# EAGLE design in-15a-single (EAGLE 6.4)
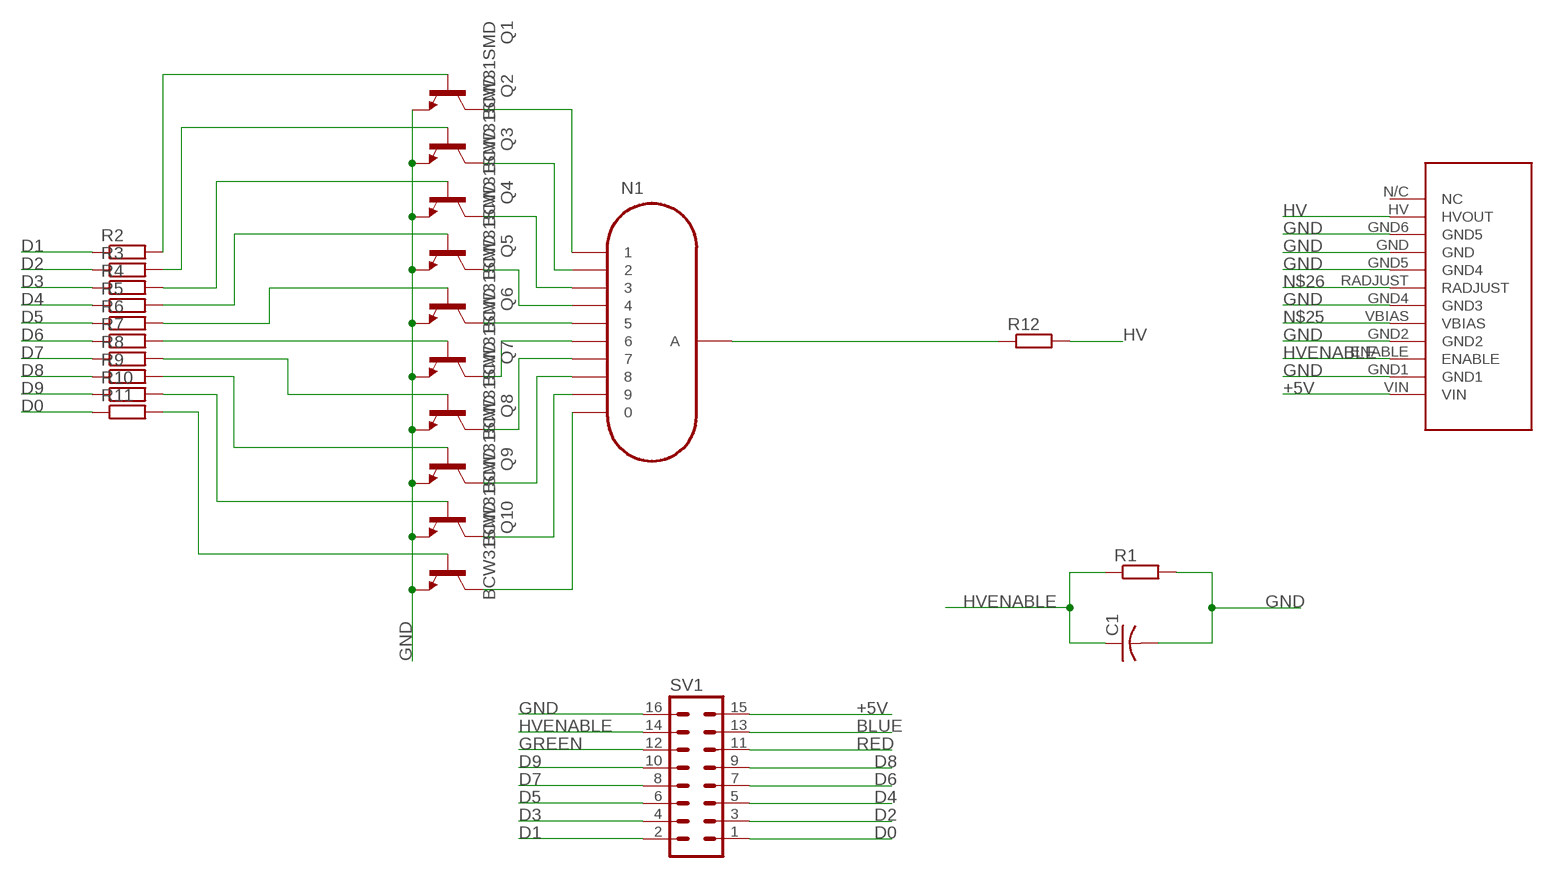
[diagram p0: schematic, sheet 1]

## Parts
C1  C-USC0805  [C0805]
N1  IN-12A  [IN-12-BIG]
Q1  BCW31SMD  [SOT23-BEC]
Q2  BCW31SMD  [SOT23-BEC]
Q3  BCW31SMD  [SOT23-BEC]
Q4  BCW31SMD  [SOT23-BEC]
Q5  BCW31SMD  [SOT23-BEC]
Q6  BCW31SMD  [SOT23-BEC]
Q7  BCW31SMD  [SOT23-BEC]
Q8  BCW31SMD  [SOT23-BEC]
Q9  BCW31SMD  [SOT23-BEC]
Q10  BCW31SMD  [SOT23-BEC]
R1  R-EU_M0805  [M0805]
R2  R-EU_M0805  [M0805]
R3  R-EU_M0805  [M0805]
R4  R-EU_M0805  [M0805]
R5  R-EU_M0805  [M0805]
R6  R-EU_M0805  [M0805]
R7  R-EU_M0805  [M0805]
R8  R-EU_M0805  [M0805]
R9  R-EU_M0805  [M0805]
R10  R-EU_M0805  [M0805]
R11  R-EU_M0805  [M0805]
R12  R-EU_M0805  [M0805]
SV1  ML16  [ML16]
U$1  HV-MODULE-EBAY  [NIIE-HV]

## Nets
+5V: SV1.15 U$1.VIN
BLUE: SV1.13
D0: R11.1 SV1.1
D1: R2.1 SV1.2
D2: R3.1 SV1.3
D3: R4.1 SV1.4
D4: R5.1 SV1.5
D5: R6.1 SV1.6
D6: R7.1 SV1.7
D7: R8.1 SV1.8
D8: R9.1 SV1.9
D9: R10.1 SV1.10
GND: C1.2 Q1.E Q2.E Q3.E Q4.E Q5.E Q6.E Q7.E Q8.E Q9.E Q10.E R1.2 SV1.16 U$1.GND U$1.GND1 U$1.GND2 U$1.GND4(GND3) U$1.GND5(GND4) U$1.GND6(GND5)
GREEN: SV1.12
HV: R12.2 U$1.HV(HVOUT)
HVENABLE: C1.1 R1.1 SV1.14 U$1.ENABLE
N$2: N1.1 Q1.C
N$3: N1.2 Q2.C
N$4: N1.3 Q3.C
N$5: N1.4 Q4.C
N$6: N1.5 Q5.C
N$7: N1.6 Q6.C
N$8: N1.7 Q7.C
N$9: N1.8 Q8.C
N$10: N1.9 Q9.C
N$11: N1.0 Q10.C
N$12: Q1.B R2.2
N$13: Q2.B R3.2
N$14: Q3.B R4.2
N$15: Q4.B R5.2
N$16: Q5.B R6.2
N$17: Q6.B R7.2
N$18: Q7.B R8.2
N$19: Q8.B R9.2
N$20: Q9.B R10.2
N$21: Q10.B R11.2
N$22: N1.A R12.1
N$25: U$1.VBIAS
N$26: U$1.RADJUST
RED: SV1.11
Unconnected: U$1.N/C(NC)

## Library data of the parts
C1 = adafruit:C-US: CAPACITOR, American symbol
N1 = russian-nixies:IN-12A: IN-12A: medium numeric topview nixie tube
Q1-Q10 = transistor-npn:BCW31*: NPN Transistor
R1-R12 = resistor:R-EU_: RESISTOR, European symbol
SV1 = con-ml:ML16: HARTING; OC_FARNELL: unknown; OC_NEWARK: unknown
U$1 = mgregg:HV-MODULE-EBAY

## Board
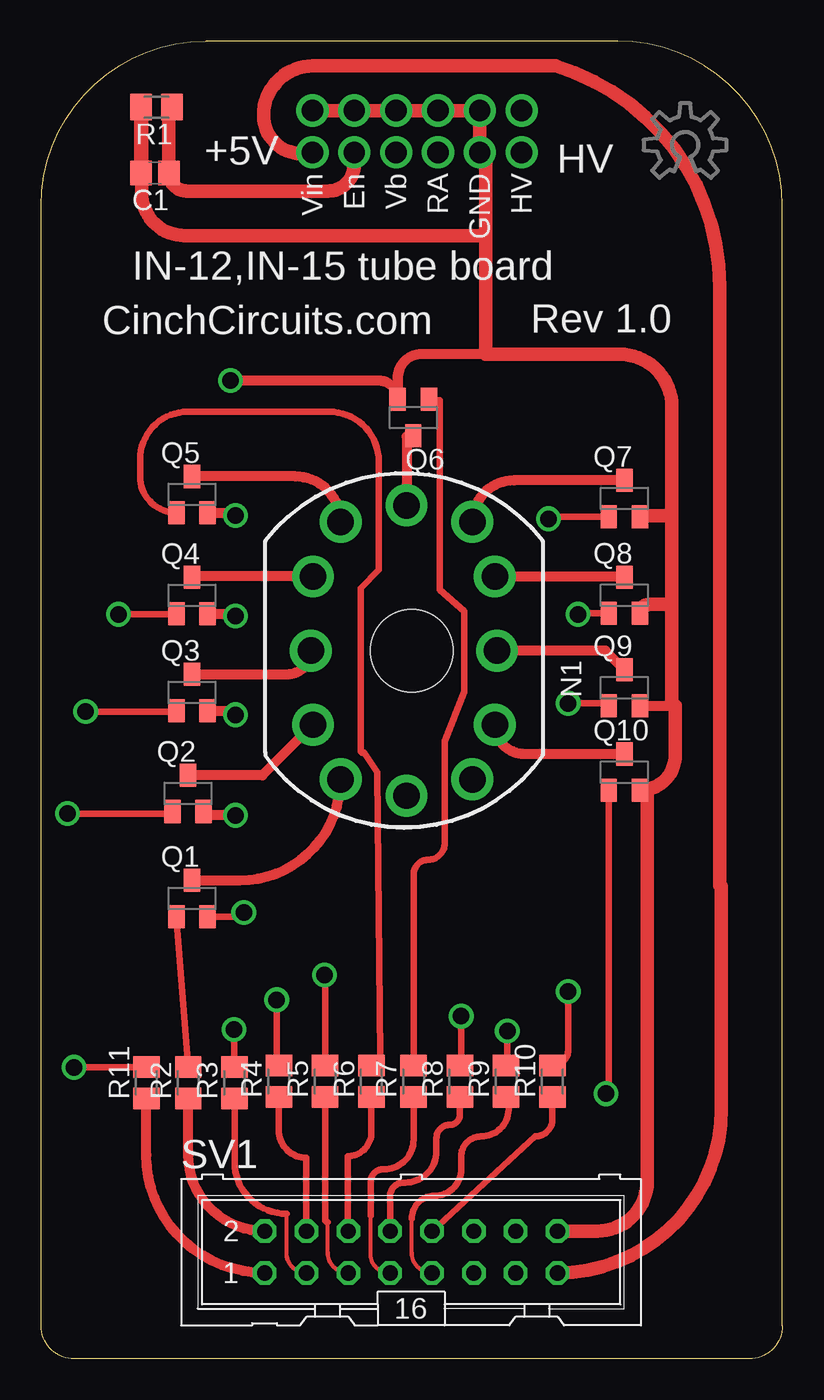
[diagram p1: board, top side]
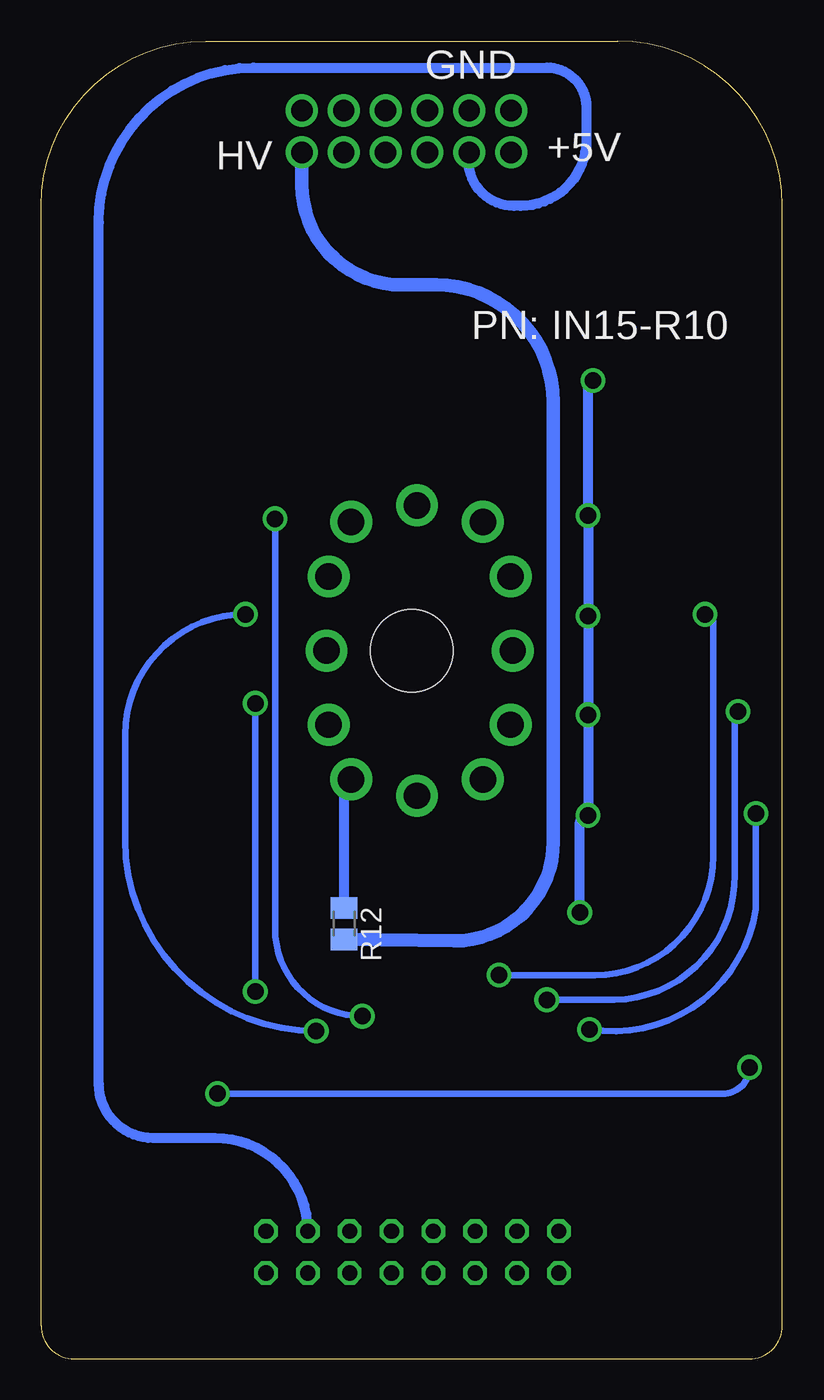
[diagram p2: board, bottom side, seen from below]

Size 45 x 80 mm. Coordinates in mm from the lower left corner, seen from the top.
Outline: 45,2 45,70 arc90 35,80 10,80 arc90 0,70 0,2 arc90 2,0 43,0 arc90 45,2
Copper layers (1*16): Top 0.035mm / dielectric 1.5mm / Bottom 0.035mm
Design rules "Fusion_eagle_rule_v1.1": minimum track width 6mil, minimum drill 12mil, track to track 6mil, track to pad 6mil, pad to pad 6mil, via to via 6mil, smd to smd 0mil, copper to edge 10mil, drill to drill 10mil, minimum pad ring 10mil, minimum via ring 6mil, stop-mask expansion 2mil, vias tented up to drill 100mil, thermal gap 10mil

### Footprints (pad centres in the part's own frame; a part is rotated, then mirrored left to right if it is on the bottom)
C0805 = smd 1.3 x 1.5: 1 -0.85,0; 2 0.85,0
IN-12-BIG = drill 1.6 pad 2.54: 0 5.048,-4.5; 1 -4.317,-7.817; 2 -6,-4.5; 3 -6.127,0; 4 -6,4.5; 5 -4.317,7.817; 6 -0.318,8.818; 7 3.683,7.817; 8 5.048,4.5; 9 5.175,0; A 3.683,-7.817; LHDP -0.318,-8.818 | hole 5: 0,0
SOT23-BEC = smd 1 x 1.4: B -0.95,-1.1; C 0,1.1; E 0.95,-1.1
M0805 = smd 1.3 x 1.6: 1 -0.95,0; 2 0.95,0
ML16 = drill 0.914 octagon: 1 -8.89,-1.27; 2 -8.89,1.27; 3 -6.35,-1.27; 4 -6.35,1.27; 5 -3.81,-1.27; 6 -3.81,1.27; 7 -1.27,-1.27; 8 -1.27,1.27; 9 1.27,-1.27; 10 1.27,1.27; 11 3.81,-1.27; 12 3.81,1.27; 13 6.35,-1.27; 14 6.35,1.27; 15 8.89,-1.27; 16 8.89,1.27
NIIE-HV = drill 1.3: ENABLE 2.54,0; GND -5.08,0; GND1 -5.08,-2.54; GND2 -2.54,-2.54; GND4 0,-2.54; GND5 2.54,-2.54; GND6 5.08,-2.54; HV -7.62,0; N/C -7.62,-2.54; RADJUST -2.54,0; VBIAS 0,0; VIN 5.08,0

### Placement (x,y rotation side)
C1  6.9,72 180 top
N1  22.5,43 0 top
Q1  9.16,27.95 0 top
Q2  8.91,34.33 0 top
Q3  9.16,40.46 0 top
Q4  9.16,46.34 0 top
Q5  9.16,52.47 0 top
Q6  22.59,57.15 180 top
Q7  35.41,52.23 0 top
Q8  35.41,46.36 0 top
Q9  35.41,40.74 0 top
Q10  35.41,35.62 0 top
R1  7,76 180 top
R2  8.93,16.76 90 top
R3  11.74,16.76 90 top
R4  14.43,16.85 90 top
R5  17.24,16.85 90 top
R6  20.05,16.85 90 top
R7  22.61,16.85 90 top
R8  25.42,16.85 90 top
R9  28.23,16.85 90 top
R10  31.04,16.85 90 top
R11  6.39,16.76 90 top
R12  26.61,26.42 270 bottom
SV1  22.46,6.48 0 top
U$1  21.55,73.25 180 top
U$2  [OSHWLOGO_TOL_0.2]  39.1,73.7 0 top

### Tracks (layer width: path | path; a pad name or v marks a point on that pad's centre or on a via)
+5V
  Top 0.813: SV1.15 arc90 41.3,15.16 41.3,28.7 arc-90 41.2,28.8 41.2,65.1 arc73 31.2,78.5 16.5,78.5 arc90 13.5,75.5 arc106 U$1.VIN
D0
  Top 0.61: SV1.1 arc-90 6.39,12.39 R11.1
D1
  Top 0.61: SV1.2 arc-90 8.93,12.39 R2.1
D2
  Top 0.254: SV1.3 arc-90 14.9,6.42 14.9,8.8
  Top 0.406: 14.9,8.8 arc-90 11.74,11.96 R3.1
D3
  Top 0.406: SV1.4 arc-90 SV1.4 16.1,12.2 arc-90 14.43,13.87 R4.1
D4
  Top 0.254: SV1.5 arc-90 17.4,6.46 17.4,8.3
  Top 0.406: 17.4,8.3 arc-90 17.24,8.46 R5.1
D5
  Top 0.406: SV1.6 arc-90 18.6,7.8 18.6,12.3 arc90 20.05,13.75 R6.1
D6
  Top 0.254: SV1.7 arc-90 20,6.3 20,8.7
  Top 0.406: 20,8.7 20,10.8 arc-90 20.8,11.5 arc90 22.61,13.31 R7.1
D7
  Top 0.406: SV1.8 21.19,9.89 arc-90 22,10.7 22.1,10.7 arc90 24,12.6 24,13.4 arc-90 24.8,14.2 arc90 25.42,14.82 R8.1
D8
  Top 0.254: SV1.9 arc-90 22.5,6.44 22.5,8.5
  Top 0.406: 22.5,8.5 arc-90 23.9,9.9 arc90 25.5,11.5 25.5,12.3 arc-90 26.7,13.5 arc115 R9.1
D9
  Top 0.406: SV1.10 30,13.5 arc90 31.04,14.54 R10.1
GND  (via drill 1)
  Top 0.406: Q1.E 12.05,26.85 arc90 v12.3,27.1
  Top 0.61: v11.8,33 10.09,33 arc-90 Q2.E | Q3.E 11.54,39.36 arc-90 v11.8,39.1 | Q4.E 11.66,45.24 arc-90 v11.8,45.1 | Q5.E 11.63,51.37 arc-90 v11.8,51.2 | v11.5,59.4 20.49,59.4 arc-90 Q6.E 21.64,59.54 arc-90 23.1,61 27,61 | Q9.E 38.5,39.64 | 36.44,45.26 Q8.E | Q10.E arc90 36.48,34.4 36.8,34.4
  Top 0.813: 36.48,34.4 arc-90 36.8,34.08 36.8,10.8 arc-90 33.75,7.75 SV1.16 | U$1.GND6 U$1.GND5 U$1.GND4 U$1.GND2 U$1.GND1 U$1.GND arc-90 27,72.88 27,68.2 | 27,68.2 27,61 35.1,61 arc-90 38.3,57.8 38.3,51.2 | 38.3,51.2 38.3,45.8 | 38.3,45.8 38.3,39.84 arc90 38.5,39.64 38.5,36.66 arc-90 Q10.E | Q8.E arc-90 36.9,45.8 38.3,45.8 | Q7.E arc-90 36.43,51.2 38.3,51.2 | C1.2 R1.2 arc-90 6.1,75.95 6.1,70.8 arc90 8.7,68.2 27,68.2
  Bottom 0.61: v12.3,27.1 12.3,32.5 arc90 v11.8,33 v11.8,39.1 v11.8,45.1 v11.8,51.2 11.8,59.1 arc90 v11.5,59.4
HV
  Bottom 0.813: R12.2 19.93,25.37 arc-90 13.9,31.4 13.9,58.08 arc-90 21.02,65.2 23.1,65.2 arc90 29.17,71.27 U$1.HV
HVENABLE
  Top 0.813: U$1.ENABLE 19.01,72.51 arc-90 17.4,70.9 8.85,70.9 arc-90 C1.1 7.75,75.8 arc-90 R1.1
  Bottom 0.61: SV1.14 arc-90 34.46,13.4 38.2,13.4 arc90 41.5,16.7 41.5,69 arc90 32.1,78.4 14.3,78.4 arc90 11.9,76 11.9,74 arc90 15.9,70 16.3,70 arc100 U$1.ENABLE
N$2
  Top 0.61: Q1.C 12.05,29.05 arc90 N1.1
N$3
  Top 0.61: N1.2 13.43,35.43 Q2.C
N$4
  Top 0.61: Q3.C 14.93,41.56 arc90 N1.3
N$5
  Top 0.61: N1.4 9.22,47.5 arc90 Q4.C
N$6
  Top 0.61: N1.5 arc90 15.43,53.57 Q5.C
N$7
  Top 0.406: 22.54,56 arc-90 Q6.C
  Top 0.61: 22.54,56 22.18,56 N1.6
N$8
  Top 0.61: Q7.C 28.7,53.33 arc90 N1.7
N$9
  Top 0.61: N1.8 35.37,47.5 arc-90 Q8.C
N$10
  Top 0.406: Q9.C arc90 35.34,41.91
  Top 0.61: 35.34,41.91 34.25,43 N1.9
N$11
  Top 0.61: Q10.C 29.33,36.72 arc-90 N1.0
N$12
  Top 0.406: R2.2 Q1.B
N$13  (via drill 1)
  Top 0.406: R3.2 v11.7,20 | v1.6,33.1 7.83,33.1 arc90 Q2.B
  Bottom 0.406: v11.7,20 arc-90 1.6,27.3 v1.6,33.1
N$14  (via drill 1)
  Top 0.406: R4.2 arc-90 14.3,17.93 v14.3,21.8 | v2.7,39.3 8.15,39.3 arc90 Q3.B
  Bottom 0.406: v14.3,21.8 10.2,21.8 arc-90 2.9,29.4 2.9,39.2 arc-90 v2.7,39.3
N$15  (via drill 1)
  Top 0.406: R5.2 17.24,23.26 arc90 v17.2,23.3 | v4.7,45.2 8.17,45.2 arc90 Q4.B
  Bottom 0.406: v17.2,23.3 11.4,23.3 arc-90 4.2,30.5 4.2,44.7 arc-90 v4.7,45.2
N$16
  Top 0.406: R6.2 arc90 20.6,18.35 20.4,35.6 19.6,36.8 arc-90 19.4,36.9 19.4,46.8 20.5,47.9 20.5,54.5 arc90 17.5,57.5 8.9,57.5 arc90 6,54.6 6,53.58 arc90 Q5.B
N$17
  Top 0.406: R7.2 22.61,29.41 arc-90 23.5,30.3 arc90 24.5,31.3 24.5,37.5 25.7,40.5 25.7,45.4 24.2,46.7 24.2,58.2 23.59,58.2 Q6.B
N$18  (via drill 1)
  Top 0.406: Q7.B 30.93,51.13 arc90 v30.8,51 | v25.5,20.8 25.5,17.88 arc-90 R8.2
  Bottom 0.406: v30.8,51 30.8,26.1 arc-90 v25.5,20.8
N$19  (via drill 1)
  Top 0.406: Q8.B 32.66,45.26 arc90 v32.6,45.2 | v28.3,19.9 28.3,17.87 arc-90 R9.2
  Bottom 0.406: v28.3,19.9 arc90 39.9,31.5 39.9,37.9 arc90 v32.6,45.2
N$20  (via drill 1)
  Top 0.406: Q9.B arc90 34.3,39.8 v32,39.8 | v32,22.3 32,18.76 arc-90 R10.2
  Bottom 0.406: v32,39.8 v32,22.3
N$21  (via drill 1)
  Top 0.406: R11.2 v2,17.7 | v34.3,16.1 arc90 34.46,16.26 Q10.B
  Bottom 0.406: v2,17.7 arc90 3.6,16.1 v34.3,16.1
N$22
  Bottom 0.61: R12.1 26.61,34.76 arc90 N1.A

### Text on the board
tPlace: +5V | HV | IN-12,IN-15 tube board | CinchCircuits.com | Rev 1.0
bPlace: GND | +5V | HV | PN: IN15-R10